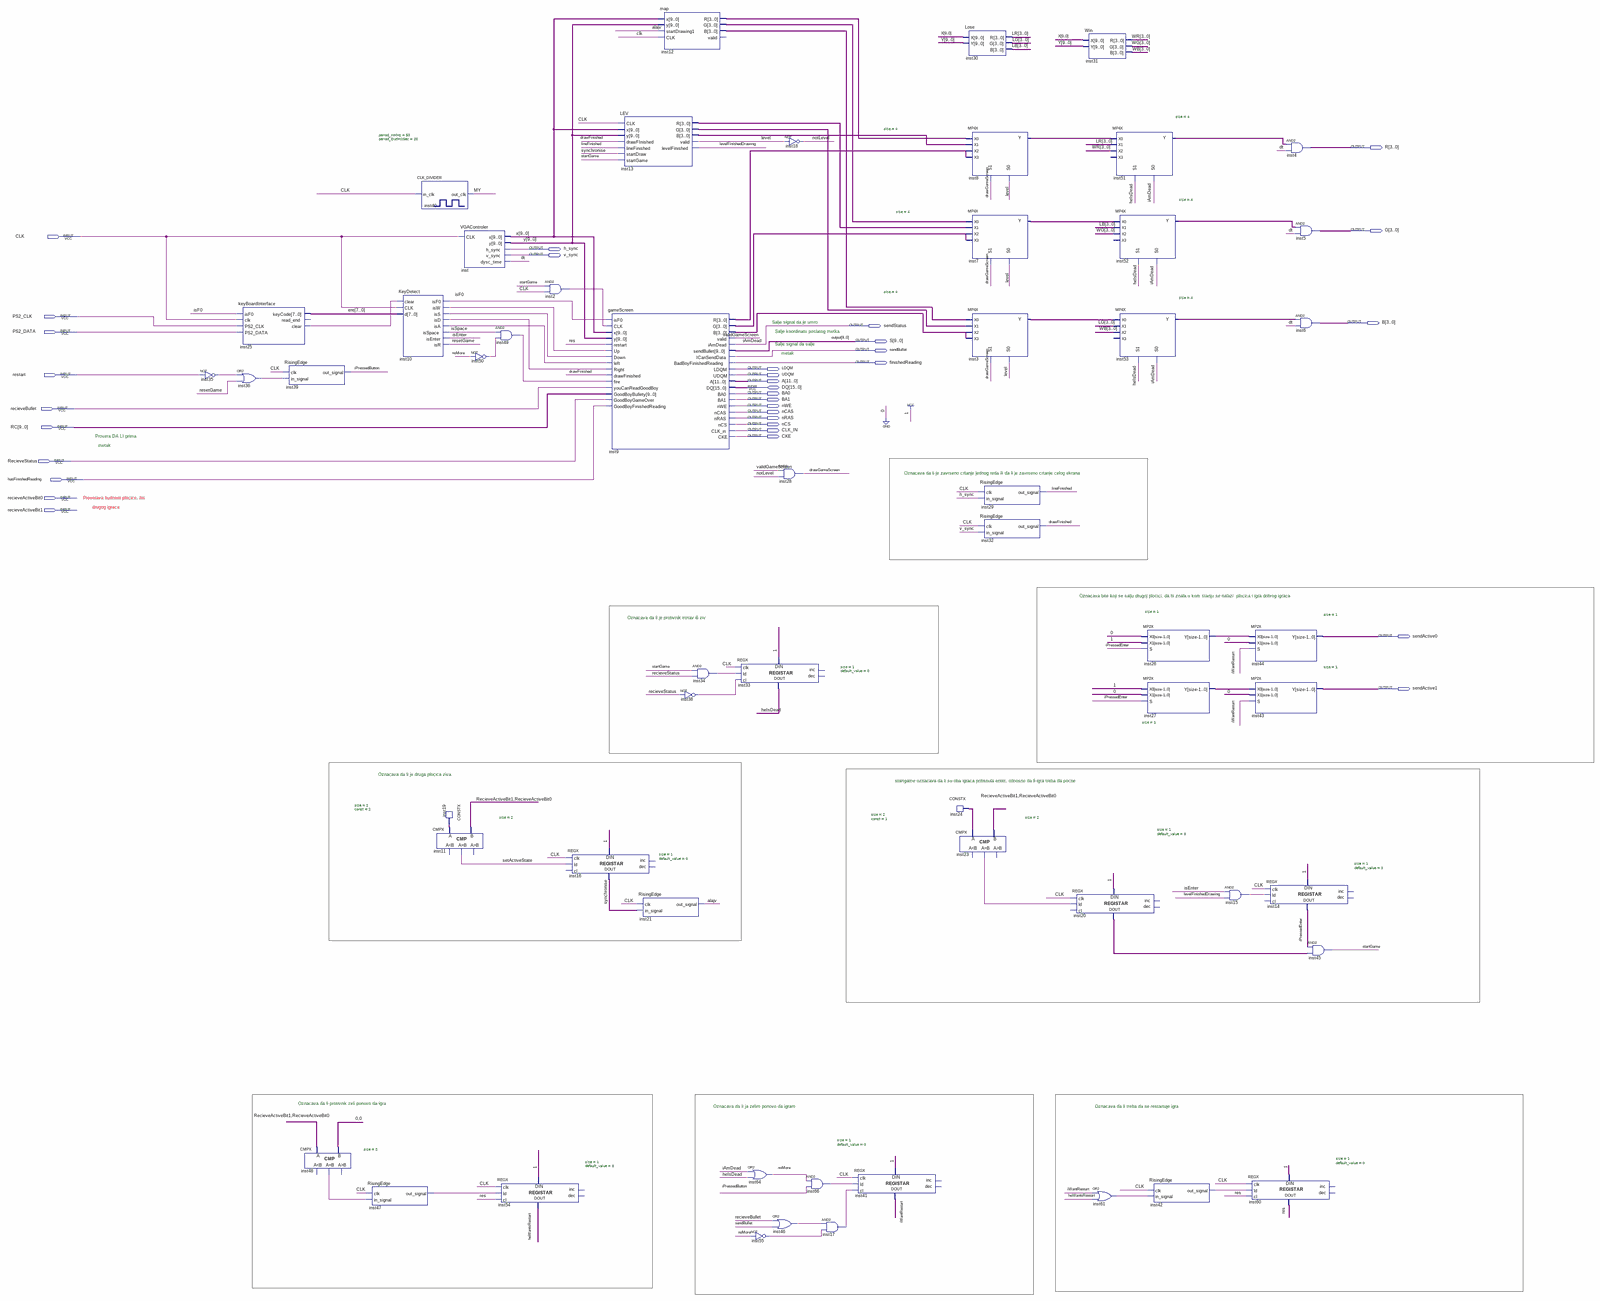
[diagram p0: schematic sheet, whole]
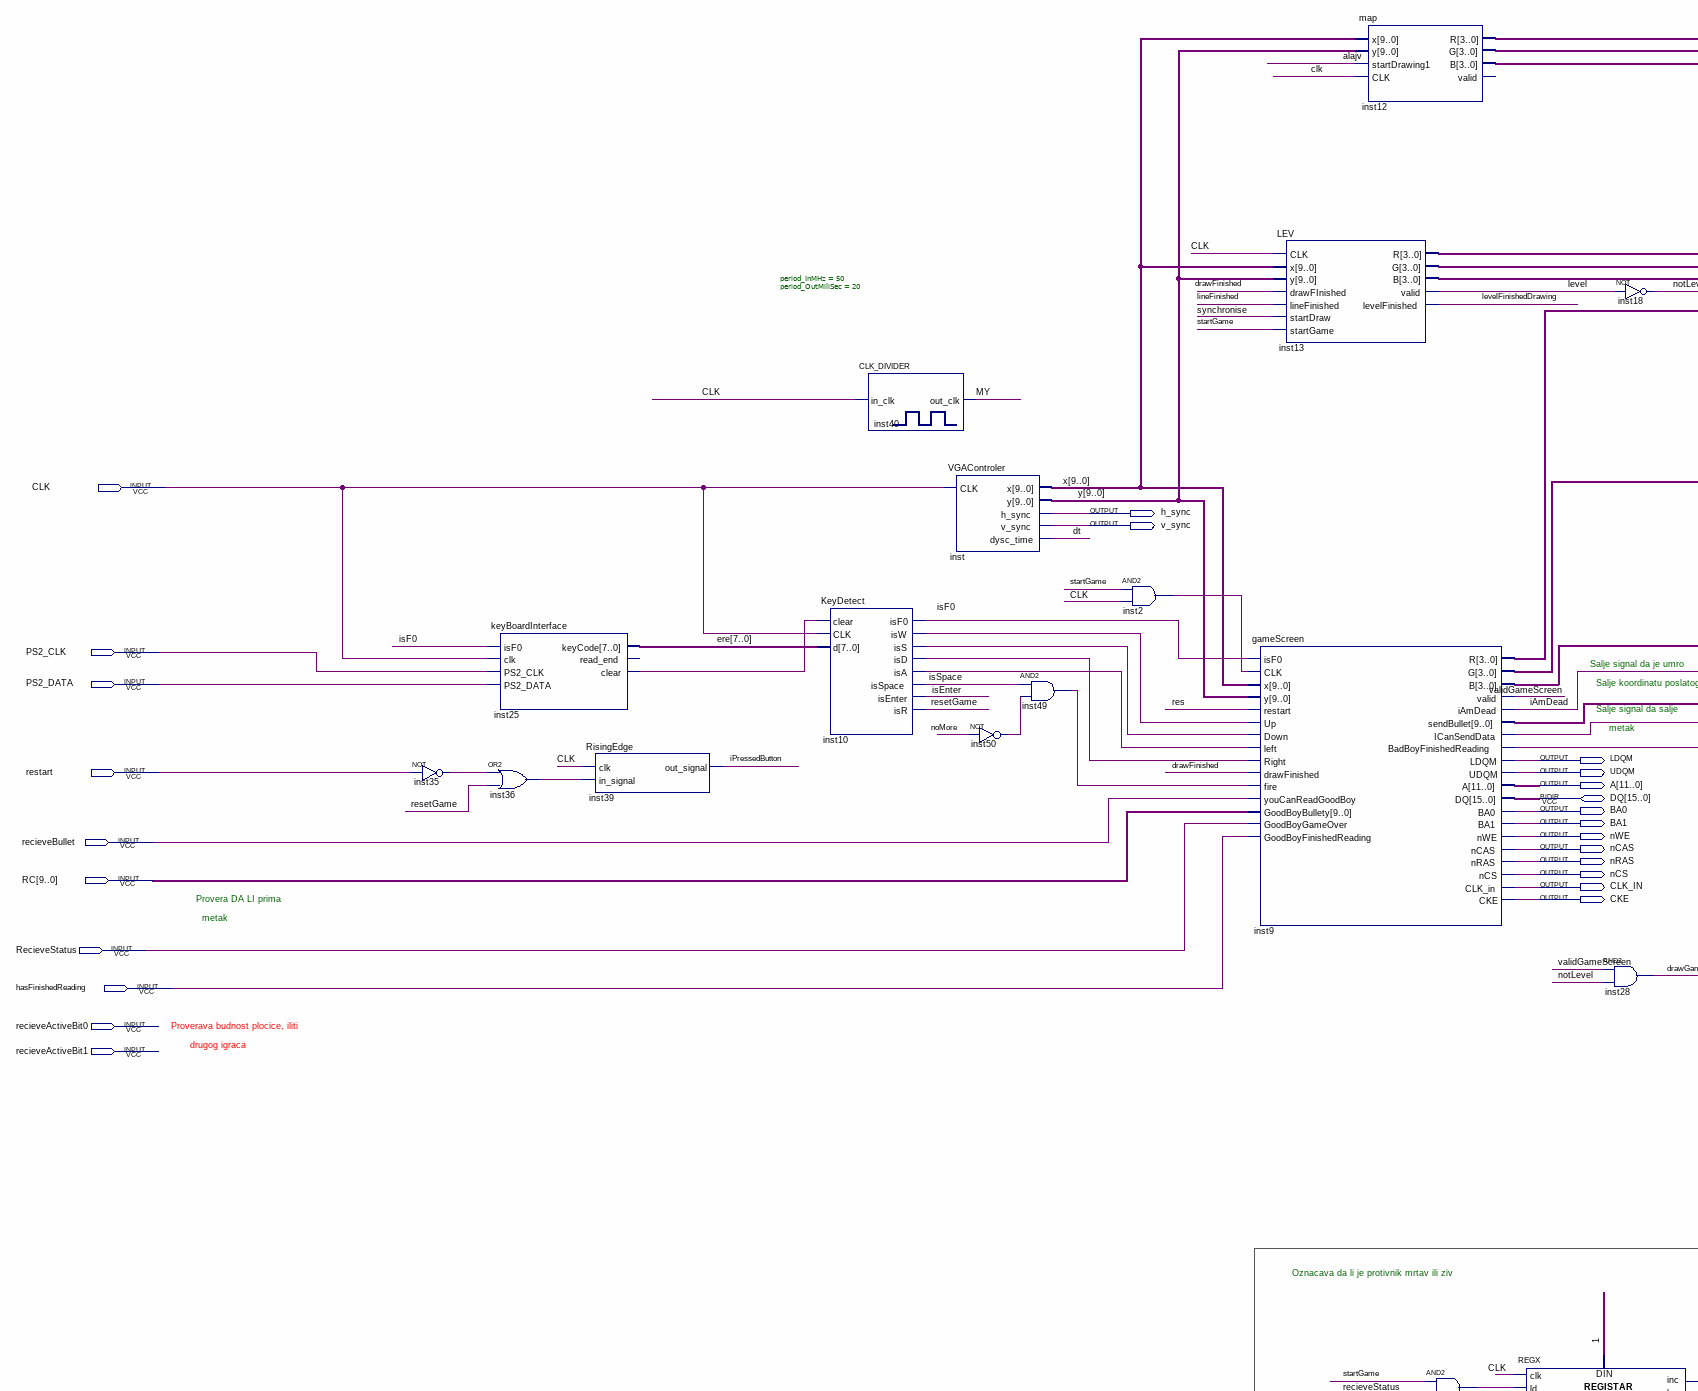
[diagram p1: schematic sheet, upper left part]
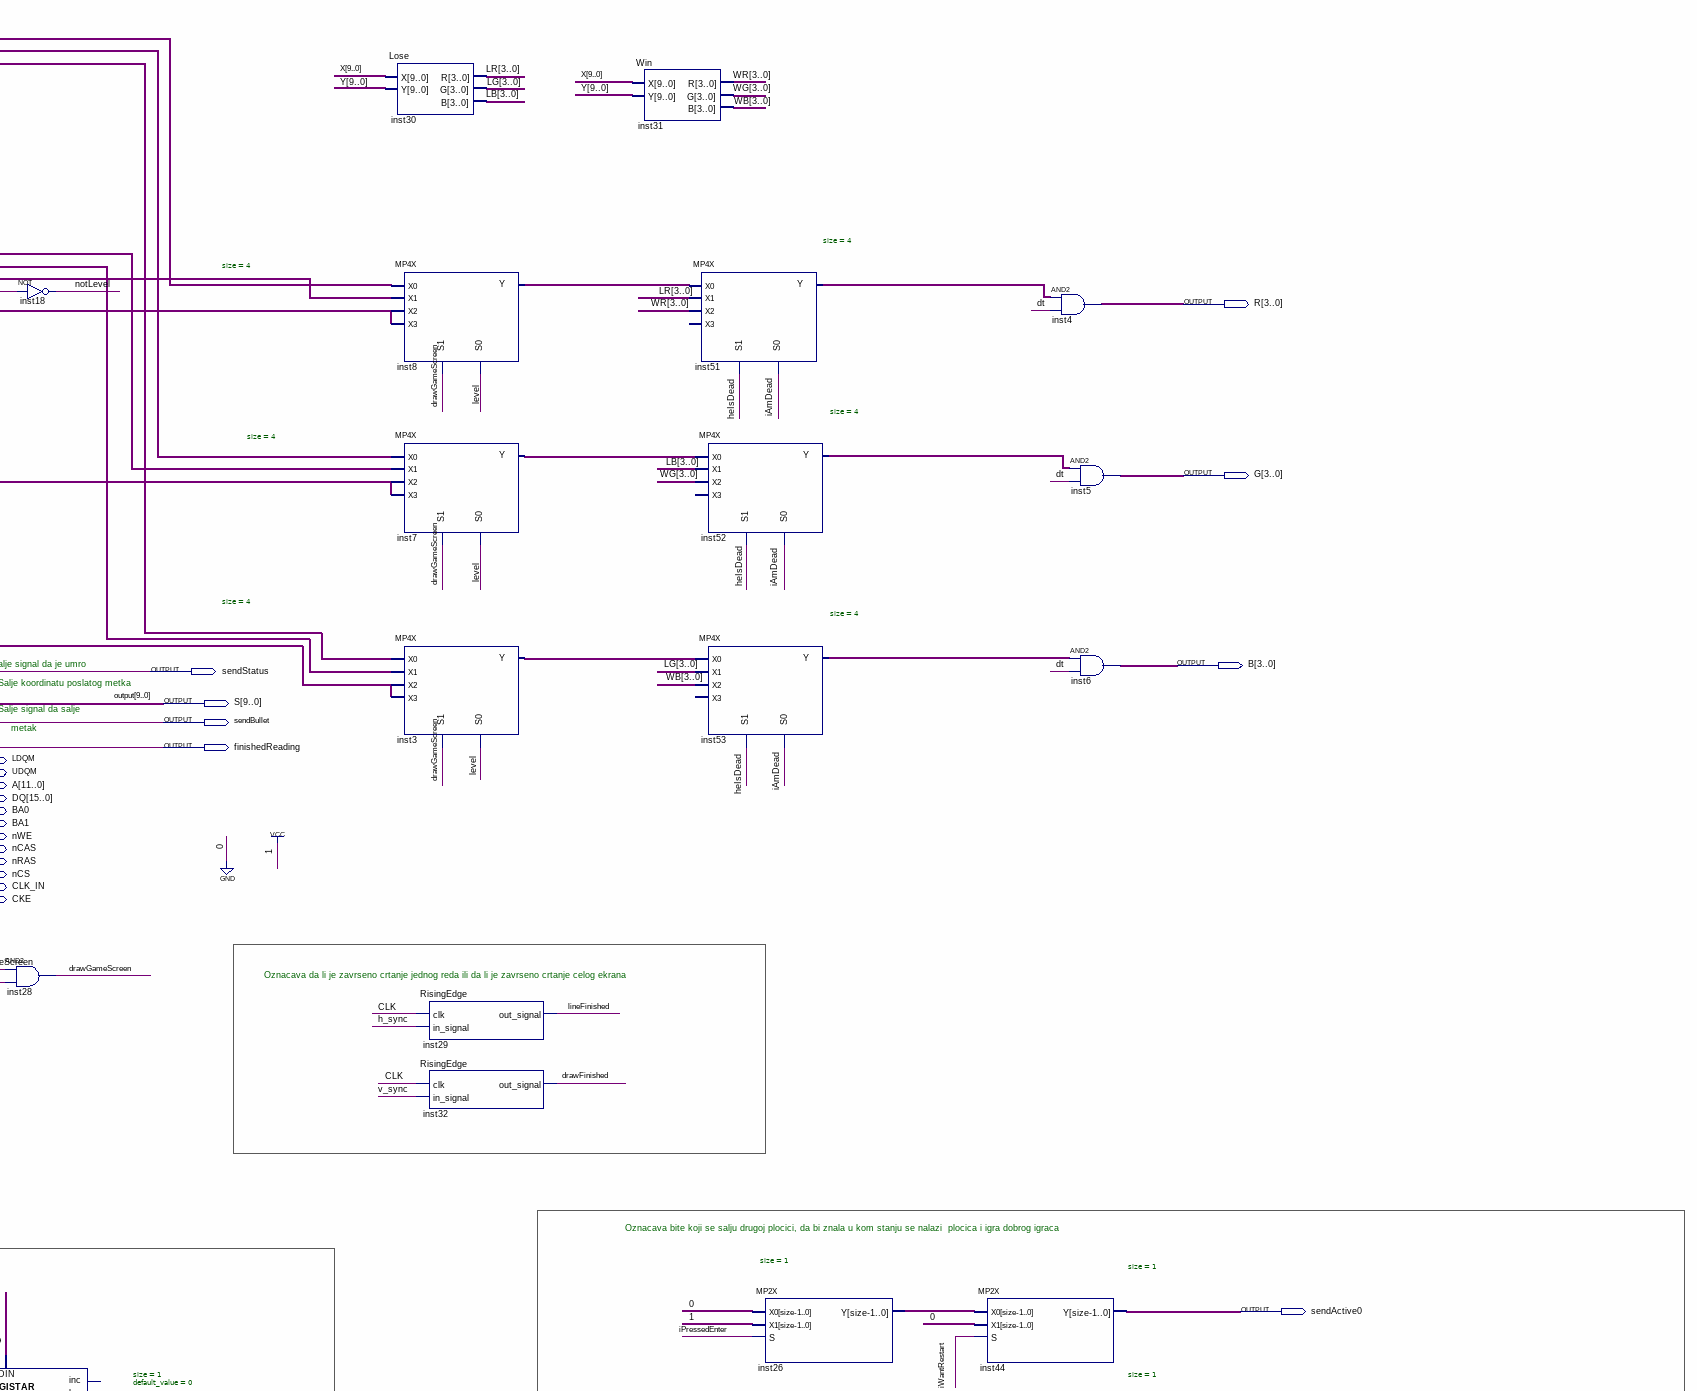
[diagram p2: schematic sheet, upper right part]
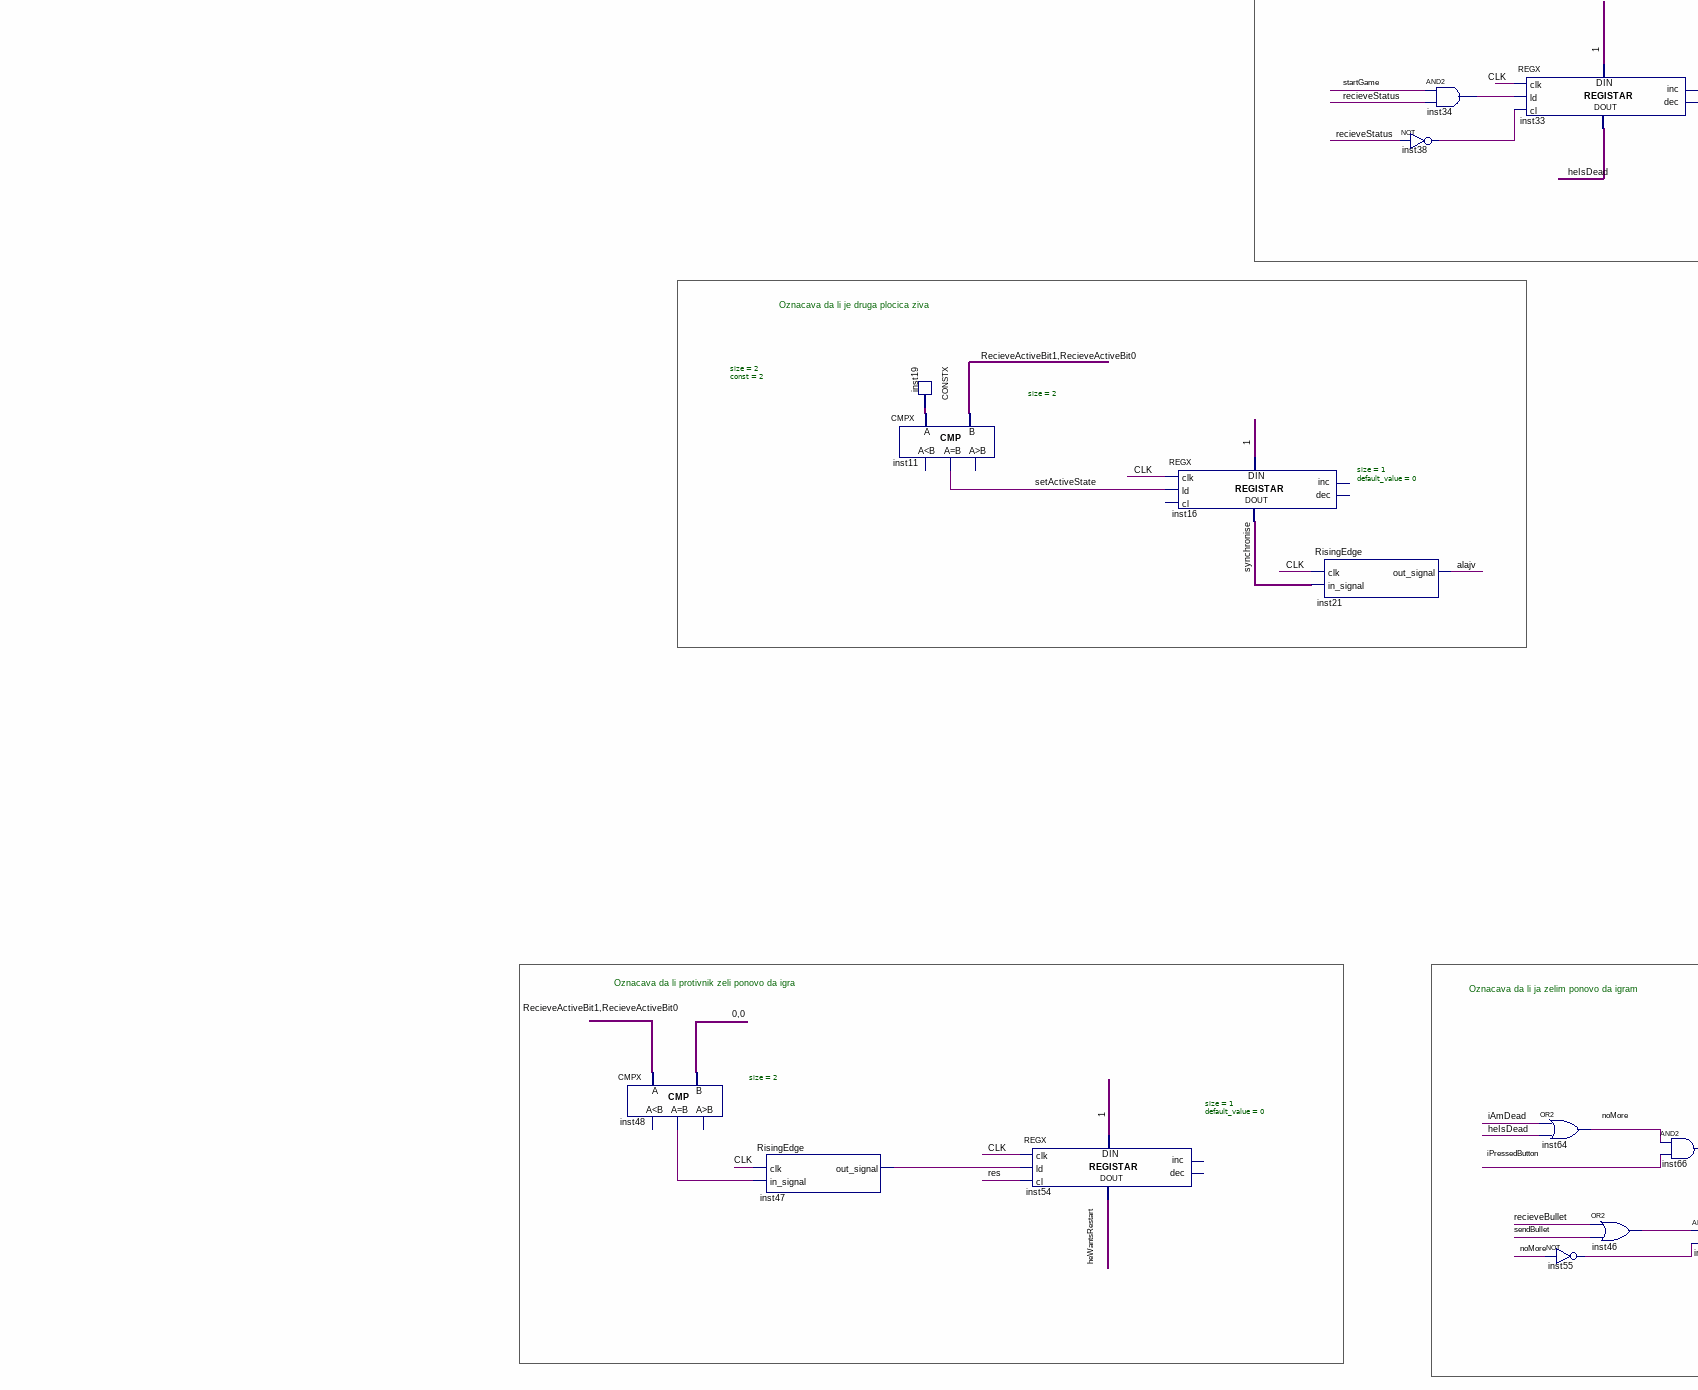
[diagram p3: schematic sheet, lower left part]
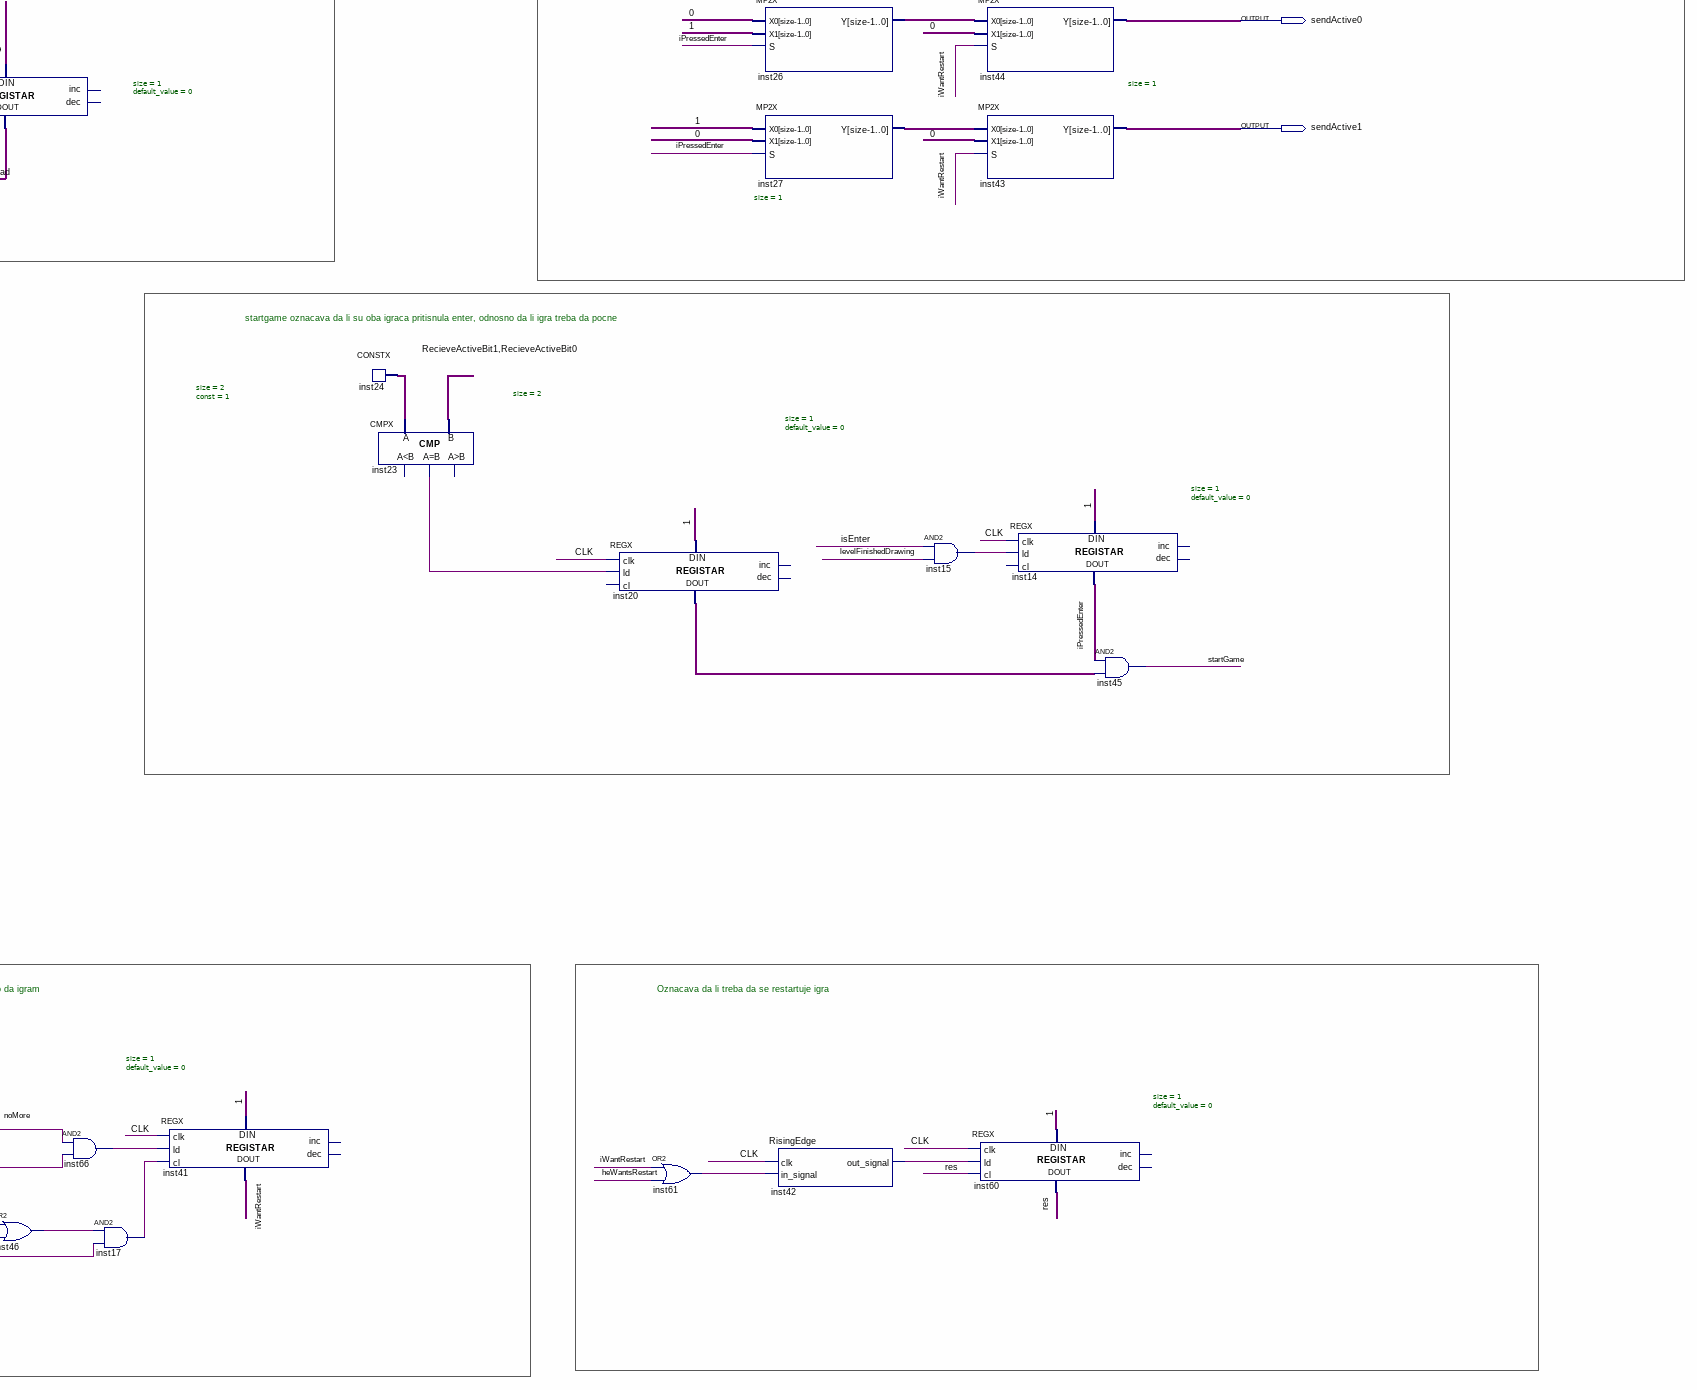
[diagram p4: schematic sheet, lower right part]
// Quartus schematic BadBoy.bdf as structural Verilog: 57 symbols, 33 pins
module BadBoy (
  input  CLK,
  input  PS2_CLK,
  input  PS2_DATA,
  input  restart,
  input  recieveBullet,
  input  [9:0] RC,
  input  RecieveStatus,
  input  hasFinishedReading,
  input  recieveActiveBit0,
  input  recieveActiveBit1,
  inout  [15:0] DQ,
  output [3:0] R,
  output [3:0] G,
  output h_sync,
  output v_sync,
  output [3:0] B,
  output sendStatus,
  output [9:0] S,
  output sendBullet,
  output finishedReading,
  output LDQM,
  output UDQM,
  output [11:0] A,
  output BA0,
  output BA1,
  output nWE,
  output nCAS,
  output nRAS,
  output nCS,
  output CLK_IN,
  output CKE,
  output sendActive0,
  output sendActive1
);

  wire alajv, drawFinished, drawGameScreen, dt, heIsDead, heWantsRestart, inst2_out, inst10_isa, inst10_isd,
       inst10_iss, inst10_isw, inst15_out, inst17_out, inst20_data_out, inst23_eq, inst25_clear, inst26_y,
       inst27_y, inst34_out, inst35_out, inst36_out, inst38_out, inst42_out_signal, inst46_out,
       inst47_out_signal, inst48_eq, inst49_out, inst50_out, inst55_out, inst61_out, inst66_out,
       iPressedButton, iPressedEnter, isEnter, isF0, isSpace, iWantRestart, level, levelFinishedDrawing,
       lineFinished, MY, noMore, notLevel, res, resetGame, setActiveState, startGame, synchronise,
       validGameScreen;
  wire [1:0] inst19_data, inst24_data;
  wire [3:0] inst3_y, inst7_y, inst8_y, inst9_b, inst9_g, inst9_r, inst12_b, inst12_g, inst12_r, inst13_b,
       inst13_g, inst13_r, inst51_y, inst52_y, inst53_y, LB, LG, LR, WB, WG, WR;
  wire [7:0] ere;
  wire [9:0] x, y;

  not inst35 (inst35_out, restart);
  keyBoardInterface inst25 (
    .isF0(isF0), .clk(CLK), .PS2_CLK(PS2_CLK), .PS2_DATA(PS2_DATA), .keyCode(ere), .clear(inst25_clear));  // open: read_end
  or inst36 (inst36_out, inst35_out, resetGame);
  RisingEdge inst39 (.clk(CLK), .in_signal(inst36_out), .out_signal(iPressedButton));
  CMPX #(.size(2)) inst48 (.A({recieveActiveBit1, recieveActiveBit0}), .B(2'b00), .eq(inst48_eq));  // open: ls, gr
  RisingEdge inst47 (.clk(CLK), .in_signal(inst48_eq), .out_signal(inst47_out_signal));
  KeyDetect inst10 (
    .clear(inst25_clear), .CLK(CLK), .d(ere), .isF0(isF0), .isW(inst10_isw), .isS(inst10_iss),
    .isD(inst10_isd), .isA(inst10_isa), .isSpace(isSpace), .isEnter(isEnter), .isR(resetGame));
  CLK_DIVIDER #(.period_InMHz(50), .period_OutMiliSec(20)) inst40 (.in_clk(CLK), .out_clk(MY));
  CONSTX #(.size(2), .\const (2)) inst19 (.data(inst19_data));
  CMPX #(.size(2)) inst11 (
    .A(inst19_data), .B({recieveActiveBit1, recieveActiveBit0}), .eq(setActiveState));  // open: ls, gr
  VGAControler inst (.CLK(CLK), .x(x), .y(y), .h_sync(h_sync), .v_sync(v_sync), .dysc_time(dt));
  not inst50 (inst50_out, noMore);
  and inst49 (inst49_out, isSpace, inst50_out);
  REGX #(.size(1), .default_value(0)) inst54 (
    .clk(CLK), .ld(inst47_out_signal), .cl(res), .data_in(1'b1), .data_out(heWantsRestart));  // open: inc, dec
  and inst2 (inst2_out, startGame, CLK);
  REGX #(.size(1), .default_value(0)) inst16 (
    .clk(CLK), .ld(setActiveState), .data_in(1'b1), .data_out(synchronise));  // open: cl, inc, dec
  LEV inst13 (
    .CLK(CLK), .x(x), .y(y), .drawFInished(drawFinished), .lineFinished(lineFinished),
    .startDraw(synchronise), .startGame(startGame), .R(inst13_r), .G(inst13_g), .B(inst13_b), .valid(level),
    .levelFinished(levelFinishedDrawing));
  gameScreen inst9 (
    .isF0(isF0), .CLK(inst2_out), .x(x), .y(y), .restart(res), .Up(inst10_isw), .Down(inst10_iss),
    .left(inst10_isa), .Right(inst10_isd), .drawFinished(drawFinished), .fire(inst49_out),
    .youCanReadGoodBoy(recieveBullet), .GoodBoyBullety(RC), .GoodBoyGameOver(RecieveStatus),
    .GoodBoyFinishedReading(hasFinishedReading), .R(inst9_r), .G(inst9_g), .B(inst9_b),
    .valid(validGameScreen), .iAmDead(sendStatus), .sendBullet(S), .ICanSendData(sendBullet),
    .BadBoyFinishedReading(finishedReading), .LDQM(LDQM), .UDQM(UDQM), .A(A), .BA0(BA0), .BA1(BA1),
    .nWE(nWE), .nCAS(nCAS), .nRAS(nRAS), .nCS(nCS), .CLK_in(CLK_IN), .CKE(CKE), .DQ(DQ));
  RisingEdge inst21 (.clk(CLK), .in_signal(synchronise), .out_signal(alajv));
  map inst12 (.x(x), .y(y), .startDrawing1(alajv), .CLK(CLK), .R(inst12_r), .G(inst12_g), .B(inst12_b));  // open: valid
  and inst34 (inst34_out, startGame, RecieveStatus);
  not inst38 (inst38_out, RecieveStatus);
  REGX #(.size(1), .default_value(0)) inst33 (
    .clk(CLK), .ld(inst34_out), .cl(inst38_out), .data_in(1'b1), .data_out(heIsDead));  // open: inc, dec
  or inst64 (noMore, sendStatus, heIsDead);
  not inst55 (inst55_out, noMore);
  not inst18 (notLevel, level);
  and inst28 (drawGameScreen, validGameScreen, notLevel);
  or inst46 (inst46_out, recieveBullet, sendBullet);
  and inst66 (inst66_out, noMore, iPressedButton);
  and inst17 (inst17_out, inst46_out, inst55_out);
  REGX #(.size(1), .default_value(0)) inst41 (
    .clk(CLK), .ld(inst66_out), .cl(inst17_out), .data_in(1'b1), .data_out(iWantRestart));  // open: inc, dec
  Lose inst30 (.X(x), .Y(y), .R(LR), .G(LG), .B(LB));
  CONSTX #(.size(2), .\const (1)) inst24 (.data(inst24_data));
  CMPX #(.size(2)) inst23 (
    .A(inst24_data), .B({recieveActiveBit1, recieveActiveBit0}), .eq(inst23_eq));  // open: ls, gr
  MP4X #(.size(4)) inst8 (
    .X0(inst12_r), .X1(inst13_b), .X2(inst9_r), .X3(inst9_r), .S1(drawGameScreen), .S0(level), .Y(inst8_y));
  MP4X #(.size(4)) inst7 (
    .X0(inst12_g), .X1(inst13_r), .X2(inst9_g), .X3(inst9_g), .S1(drawGameScreen), .S0(level), .Y(inst7_y));
  MP4X #(.size(4)) inst3 (
    .X0(inst12_b), .X1(inst13_g), .X2(inst9_b), .X3(inst9_b), .S1(drawGameScreen), .S0(level), .Y(inst3_y));
  RisingEdge inst29 (.clk(CLK), .in_signal(h_sync), .out_signal(lineFinished));
  RisingEdge inst32 (.clk(CLK), .in_signal(v_sync), .out_signal(drawFinished));
  Win inst31 (.X(x), .Y(y), .R(WR), .G(WG), .B(WB));
  REGX #(.size(1), .default_value(0)) inst20 (
    .clk(CLK), .ld(inst23_eq), .data_in(1'b1), .data_out(inst20_data_out));  // open: cl, inc, dec
  MP4X #(.size(4)) inst51 (.X0(inst8_y), .X1(LR), .X2(WR), .S1(heIsDead), .S0(sendStatus), .Y(inst51_y));  // open: X3
  or inst61 (inst61_out, iWantRestart, heWantsRestart);
  MP4X #(.size(4)) inst52 (.X0(inst7_y), .X1(LB), .X2(WG), .S1(heIsDead), .S0(sendStatus), .Y(inst52_y));  // open: X3
  MP4X #(.size(4)) inst53 (.X0(inst3_y), .X1(LG), .X2(WB), .S1(heIsDead), .S0(sendStatus), .Y(inst53_y));  // open: X3
  MP2X #(.size(1)) inst26 (.X0(1'b0), .X1(1'b1), .S(iPressedEnter), .Y(inst26_y));
  MP2X #(.size(1)) inst27 (.X0(1'b1), .X1(1'b0), .S(iPressedEnter), .Y(inst27_y));
  RisingEdge inst42 (.clk(CLK), .in_signal(inst61_out), .out_signal(inst42_out_signal));
  and inst15 (inst15_out, isEnter, levelFinishedDrawing);
  MP2X #(.size(1)) inst44 (.X0(inst26_y), .X1(1'b0), .S(iWantRestart), .Y(sendActive0));
  MP2X #(.size(1)) inst43 (.X0(inst27_y), .X1(1'b0), .S(iWantRestart), .Y(sendActive1));
  REGX #(.size(1), .default_value(0)) inst60 (
    .clk(CLK), .ld(inst42_out_signal), .cl(res), .data_in(1'b1), .data_out(res));  // open: inc, dec
  REGX #(.size(1), .default_value(0)) inst14 (
    .clk(CLK), .ld(inst15_out), .data_in(1'b1), .data_out(iPressedEnter));  // open: cl, inc, dec
  assign R = inst51_y & {4{dt}};  // AND2 inst4, 4 bits wide
  assign G = inst52_y & {4{dt}};  // AND2 inst5, 4 bits wide
  assign B = inst53_y & {4{dt}};  // AND2 inst6, 4 bits wide
  and inst45 (startGame, iPressedEnter, inst20_data_out);

  // Other names for the same wires on the sheet: output[9:0] = S; iAmDead = sendStatus

  // Notes on the sheet:
  //   Salje signal da je umro
  //   Salje koordinatu poslatog metka
  //   Salje signal da salje
  //   metak
  //   Provera DA LI prima
  //   metak
  //   Oznacava da li je zavrseno crtanje jednog reda ili da li je zavrseno crtanje celog ekrana
  //   Proverava budnost plocice, iliti
  //   drugog igraca
  //   Oznacava bite koji se salju drugoj plocici, da bi znala u kom stanju se nalazi  plocica i igra dobrog igraca                                    
  //   Oznacava da li je protivnik mrtav ili ziv
  //   Oznacava da li je druga plocica ziva
  //   startgame oznacava da li su oba igraca pritisnula enter, odnosno da li igra treba da pocne
  //   Oznacava da li protivnik zeli ponovo da igra
  //   Oznacava da li ja zelim ponovo da igram
  //   Oznacava da li treba da se restartuje igra
endmodule
